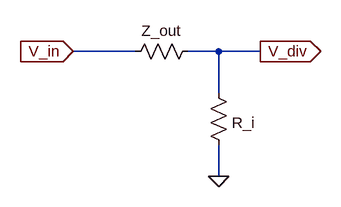
[diagram p0: schematic zo_schematic_equivalent.asc]
zo_schematic_equivalent.asc, the LTspice schematic file:
Version 4
SHEET 1 880 680
WIRE 224 64 128 64
WIRE 352 64 304 64
WIRE 416 64 352 64
WIRE 352 128 352 64
WIRE 352 256 352 208
FLAG 352 256 0
FLAG 416 64 V_div
IOPIN 416 64 Out
FLAG 128 64 V_in
IOPIN 128 64 In
SYMBOL res 320 48 R90
WINDOW 0 0 56 VBottom 2
WINDOW 3 32 56 Invisible 2
SYMATTR InstName Z_out
SYMBOL res 336 112 R0
WINDOW 0 36 40 Invisible 2
WINDOW 3 36 62 Left 2
SYMATTR InstName R_i
SYMATTR Value R_i

The netlist it stands for:
* zo_schematic_equivalent.asc
R§Z_out V_div V_in R
R_i V_div 0 R_i
.backanno
.end